# EAGLE schematic Frame2TTL_v3_0_0_Sensor (EAGLE 9.6.2)
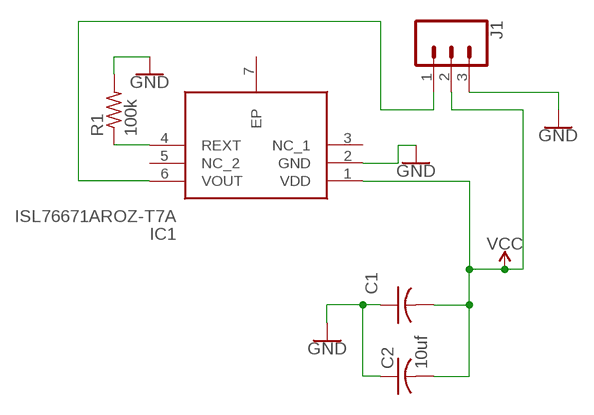
[diagram p0: schematic, sheet 1]

## Parts
C1  0.1uf  C-USC0603K  [C0603K]
C2  10uf  C-USC0805K  [C0805K]
IC1  ISL76671AROZ-T7A  [SON65P210X200X80-7N]
J1  CONN_03LOCK  [1X03_LOCK]
R1  100k  R-US_R0805  [R0805]

## Nets
GND: C1.1 C2.1 IC1.2(GND) J1.3 R1.2
N$1: IC1.6(VOUT) J1.1
N$2: IC1.4(REXT) R1.1
VCC: C1.2 C2.2 IC1.1(VDD) J1.2
Unconnected: IC1.3(NC_1) IC1.5(NC_2) IC1.7(EP)

## Library data of the parts
C1 C2 = adafruit:C-US: CAPACITOR, American symbol
IC1 = SamacSys_Parts:ISL76671AROZ-T7A: Light to Analog Sensors (Voltage) Low Power, <100 Lux Optimized, Analog Output Ambient Light Sensor Source: Datasheet <https://www.renesas.com/en-us/www/doc/datasheet/isl76671.pdf>; DESCRIPTION: Light to Analog Sensors (Voltage) Low Power, <100 Lux Optimized, Analog Output Ambient Light Sensor; HEIGHT: 0.8mm; MANUFACTURER_NAME: Renesas Electronics; MANUFACTURER_PART_NUMBER: ISL76671AROZ-T7A; MOUSER_PART_NUMBER: 968-ISL76671AROZ-T7A; MOUSER_PRICE-STOCK: https://www.mouser.com/Search/Refine.aspx?Keyword=968-ISL76671AROZ-T7A
J1 = SparkFun-Connectors:CONN_03: Multi connection point. Often used as Generic Header-pin footprint for 0.1 inch spaced/style header connections On any of the 0.1 inch spaced packages, you can populate with these: Break Away Headers - Straight <https://www.sparkfun.com/products/116> (PRT-00116) Break Away Male Headers - Right Angle <https://www.sparkfun.com/products/553> (PRT-00553) Female Headers <https://www.sparkfun.com/products/115> (PRT-00115) Break Away Headers - Machine Pin <https://www.sparkfun.com/products/117> (PRT-00117) Break Away Female Headers - Swiss Machine Pin <https://www.sparkfun.com/products/743> (PRT-00743) Stackable Header - 3 Pin (Female, 0.1") <https://www.sparkfun.com/products/13875> (PRT-13875) For SCREWTERMINALS and SPRING TERMINALS visit here: Screw Terimnals on SparkFun.com <https://www.sparkfun.com/search/results?term=Screw+Terminals> (5mm/3.5mm/2.54mm spacing) This device is also useful as a general connection point to wire up your design to another part of your project. Our various solder wires solder well into these plated through hole pads. Hook-Up Wire - Assortment (Stranded, 22 AWG) <https://www.sparkfun.com/products/11375> (PRT-11375) Hook-Up Wire - Assortment (Solid Core, 22 AWG) <https://www.sparkfun.com/products/11367> (PRT-11367) View the entire wire category on our website here <https://www.sparkfun.com/categories/141> Special notes: Molex polarized connector foot print use with SKU : PRT-08232 with associated crimp pins and housings.
R1 = adafruit:R-US_: RESISTOR, American symbol